# EAGLE design ver1.0 (EAGLE 7.3.0)
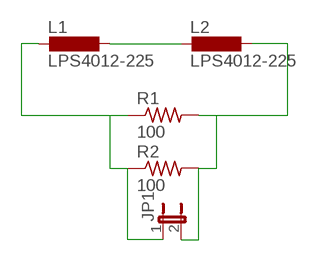
[diagram p0: schematic, sheet 1]

## Parts
JP1  JP1E  [JP1]
L1  LPS4012-225  MSS7341  [MSS7341]
L2  LPS4012-225  MSS7341  [MSS7341]
R1  100  R-US_R0603  [R0603]
R2  100  R-US_R0603  [R0603]

## Nets
N$1: L1.P$2 L2.P$1
N$2: JP1.1 L1.P$1 R1.1 R2.1
N$3: JP1.2 L2.P$2 R1.2 R2.2

## Library data of the parts
JP1 = jumper:JP1E: JUMPER
L1 L2 = Coilcraft_Inductors:MSS7341: Shielded Power Inductors Package 6.6 × 6.6 mm x 4.1 mm high Source: http://www.farnell.com/datasheets/1681958.pdf
R1 R2 = rcl:R-US_: RESISTOR, American symbol

## Board
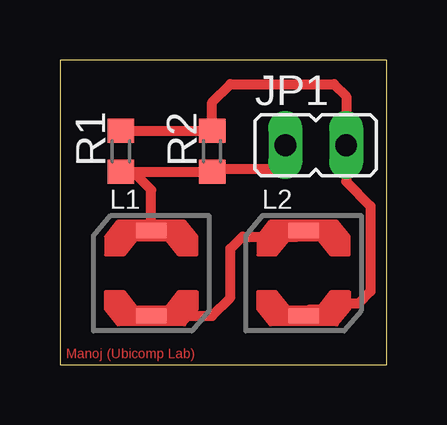
[diagram p1: board, top side]

Size 13.64 x 12.69 mm. Coordinates in mm from the lower left corner, seen from the top.
Outline: 0,0 13.64,0 13.64,12.69 0,12.69 0,0
Copper layers (1*16): Top 0.035mm / dielectric 1.5mm / Bottom 0.035mm
Design rules "default": minimum track width 10mil, minimum drill 24mil, track to track 8mil, track to pad 8mil, pad to pad 8mil, via to via 8mil, smd to smd 8mil, copper to edge 40mil, drill to drill 8mil, minimum pad ring 10mil, minimum via ring 8mil, stop-mask expansion 4mil, vias tented up to drill 0mil, thermal gap 10mil

### Footprints (pad centres in the part's own frame; a part is rotated, then mirrored left to right if it is on the bottom)
JP1 = drill 0.914 long: 1 0,-1.27; 2 0,1.27
MSS7341 = smd 1.27 x 0.635: P$1 0,1.778; P$2 0,-1.778
R0603 = smd 1 x 1.1: 1 -0.85,0; 2 0.85,0

### Placement (x,y rotation side)
JP1  10.67,9.14 270 top
L1  3.81,3.81 0 top
L2  10.16,3.81 0 top
R1  2.54,8.89 90 top
R2  6.35,8.89 90 top

### Tracks (layer width: path | path; a pad name or v marks a point on that pad's centre or on a via)
N$1
  Top 0.406: L1.P$2 6.35,2.03 7.11,2.79 7.11,4.83 7.62,5.33 9.91,5.33 L2.P$1
N$2
  Top 0.406: JP1.1 9.4,8.38 9.14,8.13 6.44,8.13 R2.1 3.05,8.04 | R1.1 3.05,8.04 | L1.P$1 3.81,7.28 3.05,8.04
N$3
  Top 0.406: R1.2 R2.2 6.35,10.92 7.11,11.68 11.43,11.68 11.94,11.18 JP1.2 11.94,7.62 12.95,6.6 12.95,3.05 12.45,2.54 11.43,2.54 11.18,2.29 10.41,2.29 L2.P$2

### Text on the board
Top: Manoj (Ubicomp Lab)